# EAGLE schematic GPIOexpander (EAGLE 9.4.2)
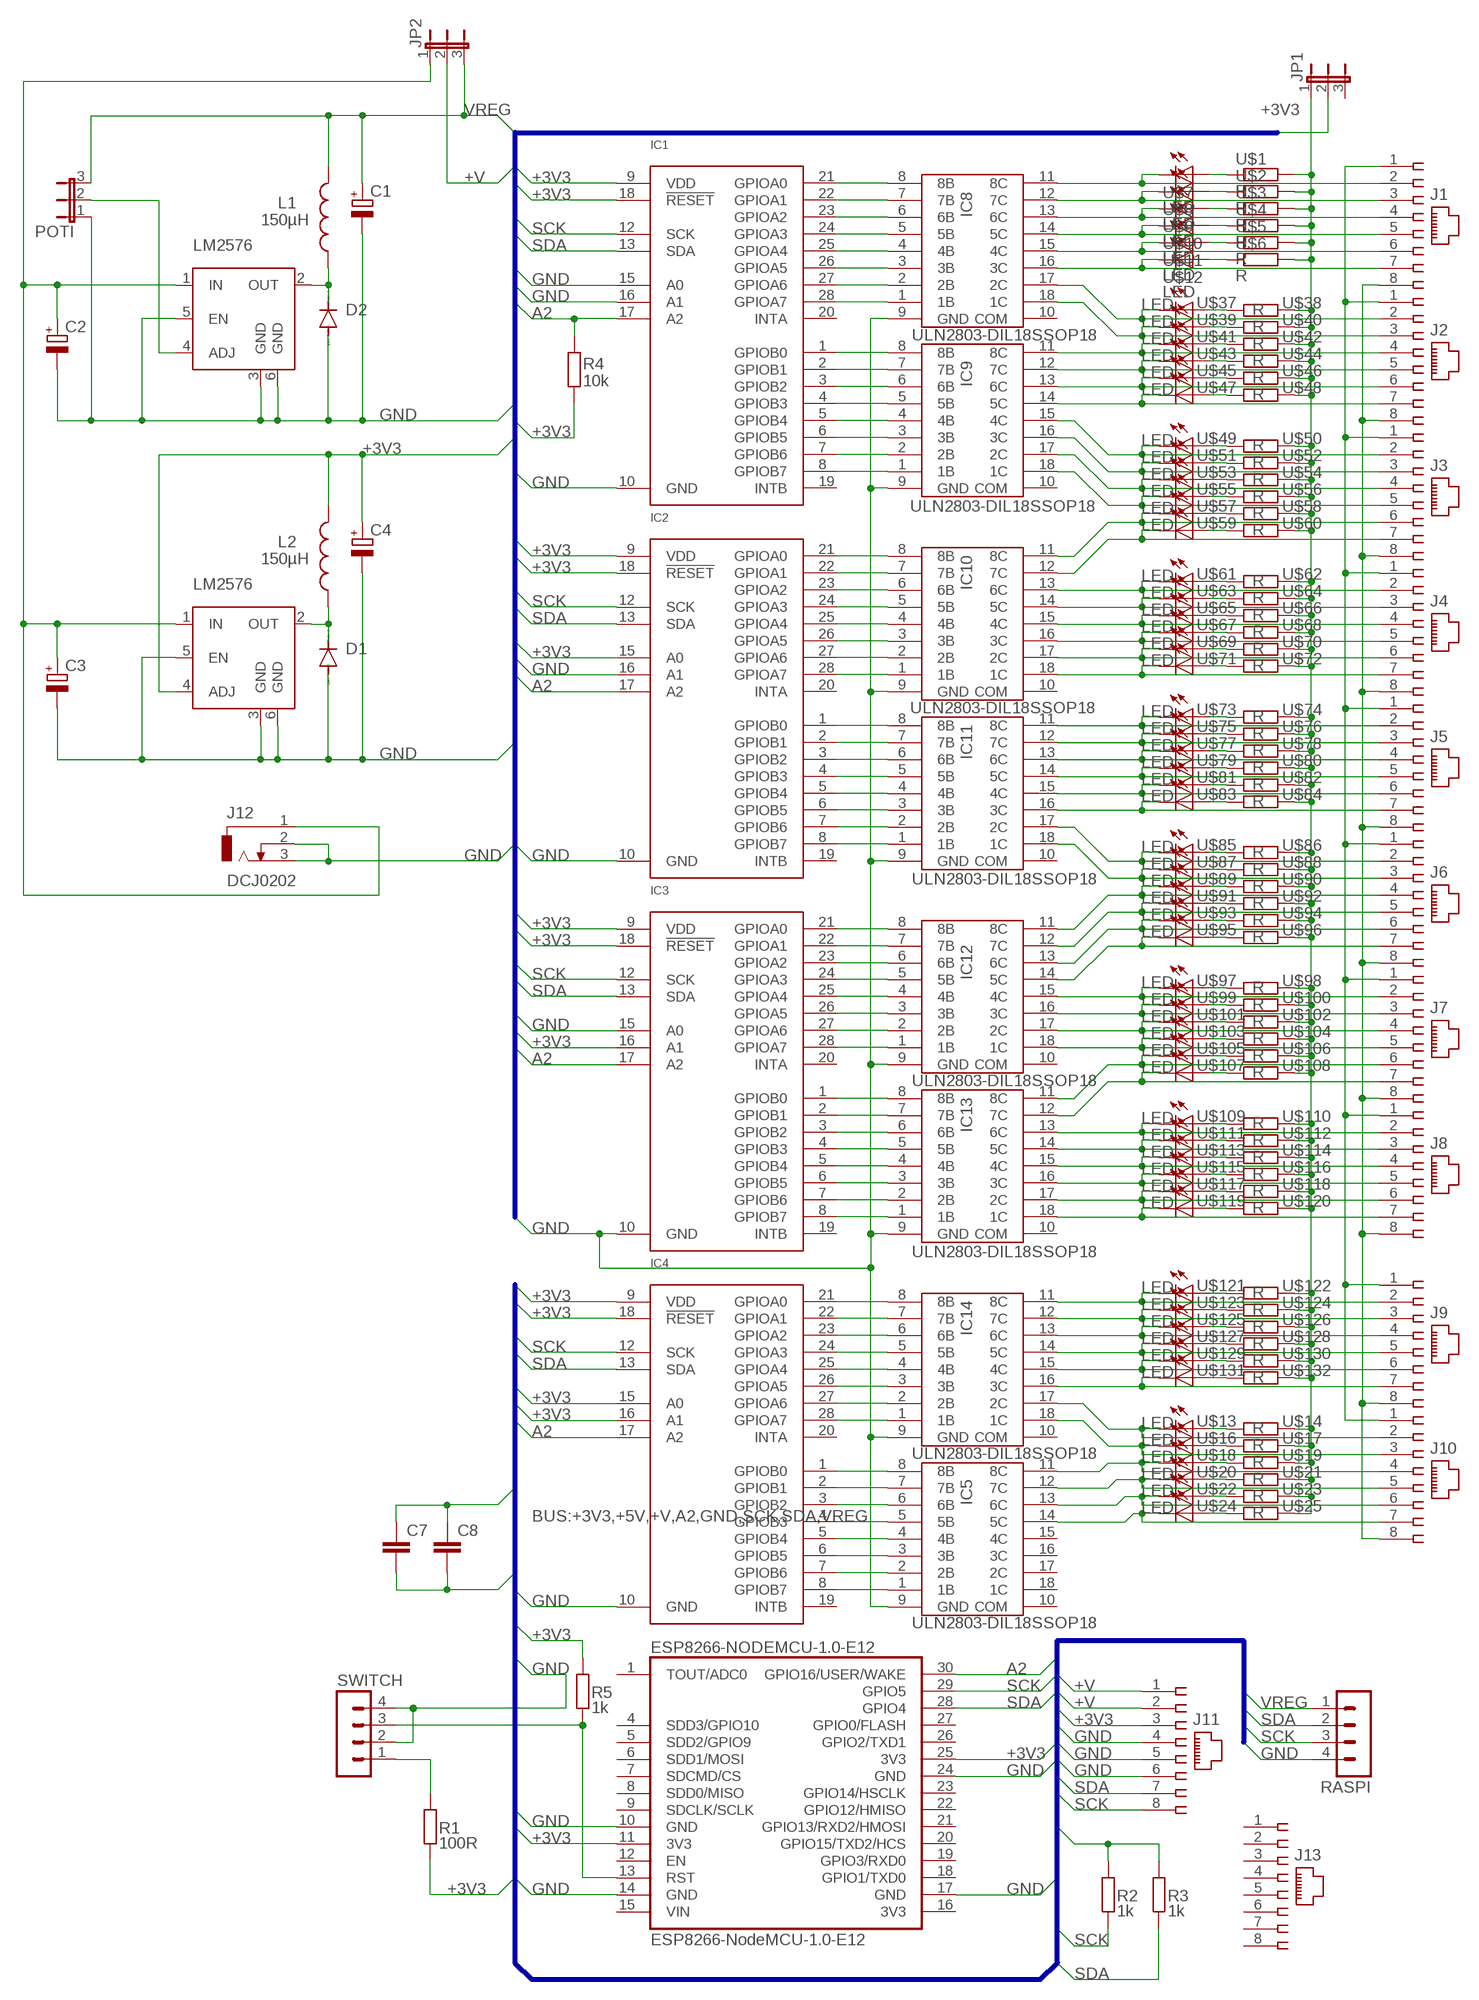
[diagram p0: schematic, sheet 1]

## Parts
C1  CPOL-EUE5-10.5  [E5-10,5]
C2  CPOL-EUE5-10.5  [E5-10,5]
C3  CPOL-EUE5-10.5  [E5-10,5]
C4  CPOL-EUE5-10.5  [E5-10,5]
C7  C-EUC0805  [C0805]
C8  C-EUC0805  [C0805]
D1  DIODE-SMB  [SMB]
D2  DIODE-SMB  [SMB]
ESP8266-NODEMCU-1.0-E12  ESP8266-NodeMCU-1.0-E12  MCP8266-MODULE  [MCP8266-MODULE]
IC1  MCP23017-DIL28-3SSOP28  [SO28W]
IC2  MCP23017-DIL28-3SSOP28  [SO28W]
IC3  MCP23017-DIL28-3SSOP28  [SO28W]
IC4  MCP23017-DIL28-3SSOP28  [SO28W]
IC5  ULN2803-DIL18SSOP18  [SO18W]
IC8  ULN2803-DIL18SSOP18  [SO18W]
IC9  ULN2803-DIL18SSOP18  [SO18W]
IC10  ULN2803-DIL18SSOP18  [SO18W]
IC11  ULN2803-DIL18SSOP18  [SO18W]
IC12  ULN2803-DIL18SSOP18  [SO18W]
IC13  ULN2803-DIL18SSOP18  [SO18W]
IC14  ULN2803-DIL18SSOP18  [SO18W]
J1  215877-7  [215877-7]
J2  215877-7  [215877-7]
J3  215877-7  [215877-7]
J4  215877-7  [215877-7]
J5  215877-7  [215877-7]
J6  215877-7  [215877-7]
J7  215877-7  [215877-7]
J8  215877-7  [215877-7]
J9  215877-7  [215877-7]
J10  215877-7  [215877-7]
J11  215877-7  [215877-7]
J12  DCJ0202  [DCJ0303]
J13  215877-7  [215877-7]
JP1  JP2E  [JP2]
JP2  JP2E  [JP2]
L1  150µH  BIG_COILS  [BIG_COIL]
L2  150µH  BIG_COILS  [BIG_COIL]
POTI  JP2E  [JP2]
R1  100R  R  [C0805]
R2  1k  R  [C0805]
R3  1k  R  [C0805]
R4  10k  R  [C0805]
R5  1k  R  [C0805]
RASPI  MA04-1  [MA04-1]
SWITCH  MA04-1  [MA04-1]
U$1  R  [C0805]
U$2  R  [C0805]
U$3  R  [C0805]
U$4  R  [C0805]
U$5  R  [C0805]
U$6  R  [C0805]
U$7  LED  [C0805]
U$8  LED  [C0805]
U$9  LED  [C0805]
U$10  LED  [C0805]
U$11  LED  [C0805]
U$12  LED  [C0805]
U$13  LED  [C0805]
U$14  R  [C0805]
U$16  LED  [C0805]
U$17  R  [C0805]
U$18  LED  [C0805]
U$19  R  [C0805]
U$20  LED  [C0805]
U$21  R  [C0805]
U$22  LED  [C0805]
U$23  R  [C0805]
U$24  LED  [C0805]
U$25  R  [C0805]
U$26  LM2576  [D2PAK]
U$28  LM2576  [D2PAK]
U$37  LED  [C0805]
U$38  R  [C0805]
U$39  LED  [C0805]
U$40  R  [C0805]
U$41  LED  [C0805]
U$42  R  [C0805]
U$43  LED  [C0805]
U$44  R  [C0805]
U$45  LED  [C0805]
U$46  R  [C0805]
U$47  LED  [C0805]
U$48  R  [C0805]
U$49  LED  [C0805]
U$50  R  [C0805]
U$51  LED  [C0805]
U$52  R  [C0805]
U$53  LED  [C0805]
U$54  R  [C0805]
U$55  LED  [C0805]
U$56  R  [C0805]
U$57  LED  [C0805]
U$58  R  [C0805]
U$59  LED  [C0805]
U$60  R  [C0805]
U$61  LED  [C0805]
U$62  R  [C0805]
U$63  LED  [C0805]
U$64  R  [C0805]
U$65  LED  [C0805]
U$66  R  [C0805]
U$67  LED  [C0805]
U$68  R  [C0805]
U$69  LED  [C0805]
U$70  R  [C0805]
U$71  LED  [C0805]
U$72  R  [C0805]
U$73  LED  [C0805]
U$74  R  [C0805]
U$75  LED  [C0805]
U$76  R  [C0805]
U$77  LED  [C0805]
U$78  R  [C0805]
U$79  LED  [C0805]
U$80  R  [C0805]
U$81  LED  [C0805]
U$82  R  [C0805]
U$83  LED  [C0805]
U$84  R  [C0805]
U$85  LED  [C0805]
U$86  R  [C0805]
U$87  LED  [C0805]
U$88  R  [C0805]
U$89  LED  [C0805]
U$90  R  [C0805]
U$91  LED  [C0805]
U$92  R  [C0805]
U$93  LED  [C0805]
U$94  R  [C0805]
U$95  LED  [C0805]
U$96  R  [C0805]
U$97  LED  [C0805]
U$98  R  [C0805]
U$99  LED  [C0805]
U$100  R  [C0805]
U$101  LED  [C0805]
U$102  R  [C0805]
U$103  LED  [C0805]
U$104  R  [C0805]
U$105  LED  [C0805]
U$106  R  [C0805]
U$107  LED  [C0805]
U$108  R  [C0805]
U$109  LED  [C0805]
U$110  R  [C0805]
U$111  LED  [C0805]
U$112  R  [C0805]
U$113  LED  [C0805]
U$114  R  [C0805]
U$115  LED  [C0805]
U$116  R  [C0805]
U$117  LED  [C0805]
U$118  R  [C0805]
U$119  LED  [C0805]
U$120  R  [C0805]
U$121  LED  [C0805]
U$122  R  [C0805]
U$123  LED  [C0805]
U$124  R  [C0805]
U$125  LED  [C0805]
U$126  R  [C0805]
U$127  LED  [C0805]
U$128  R  [C0805]
U$129  LED  [C0805]
U$130  R  [C0805]
U$131  LED  [C0805]
U$132  R  [C0805]

## Nets
+3V3: C4.+ C7.1 C8.1 ESP8266-NODEMCU-1.0-E12.11(3V3) ESP8266-NODEMCU-1.0-E12.25(3V3) IC1.9(VDD) IC1.18(!RESET) IC2.9(VDD) IC2.15(A0) IC2.18(!RESET) IC3.9(VDD) IC3.16(A1) IC3.18(!RESET) IC4.9(VDD) IC4.15(A0) IC4.16(A1) IC4.18(!RESET) J11.3 JP1.2 L2.P$2 R1.1 R2.2 R3.2 R4.1 R5.2 U$28.4(ADJ)
+V: J1.1 J2.1 J3.1 J4.1 J5.1 J6.1 J7.1 J8.1 J9.1 J10.1 J11.1 J11.2 JP2.2
A2: ESP8266-NODEMCU-1.0-E12.30(GPIO16/USER/WAKE) IC1.17(A2) IC2.17(A2) IC3.17(A2) IC4.17(A2) R4.2
GND: C1.- C2.- C3.- C4.- C7.2 C8.2 D1.A D2.A ESP8266-NODEMCU-1.0-E12.10(GND) ESP8266-NODEMCU-1.0-E12.14(GND) ESP8266-NODEMCU-1.0-E12.17(GND) ESP8266-NODEMCU-1.0-E12.24(GND) IC1.10(GND) IC1.15(A0) IC1.16(A1) IC2.10(GND) IC2.16(A1) IC3.10(GND) IC3.15(A0) IC4.10(GND) IC5.9(GND) IC8.9(GND) IC9.9(GND) IC10.9(GND) IC11.9(GND) IC12.9(GND) IC13.9(GND) IC14.9(GND) J1.8 J2.8 J3.8 J4.8 J5.8 J6.8 J7.8 J8.8 J9.8 J10.8 J11.4 J11.5 J11.6 J12.2 J12.3 POTI.1 RASPI.4 SWITCH.2 SWITCH.4 U$26.3(GND) U$26.5(EN) U$26.6(GND) U$28.3(GND) U$28.5(EN) U$28.6(GND)
N$1: IC1.21(GPIOA0) IC8.8(8B)
N$2: IC1.22(GPIOA1) IC8.7(7B)
N$3: IC1.23(GPIOA2) IC8.6(6B)
N$4: IC1.24(GPIOA3) IC8.5(5B)
N$5: IC1.25(GPIOA4) IC8.4(4B)
N$6: IC1.26(GPIOA5) IC8.3(3B)
N$7: IC1.27(GPIOA6) IC8.2(2B)
N$8: IC1.28(GPIOA7) IC8.1(1B)
N$9: IC4.8(GPIOB7) IC5.1(1B)
N$10: IC1.1(GPIOB0) IC9.8(8B)
N$11: IC1.2(GPIOB1) IC9.7(7B)
N$12: IC1.3(GPIOB2) IC9.6(6B)
N$13: IC1.4(GPIOB3) IC9.5(5B)
N$14: IC1.5(GPIOB4) IC9.4(4B)
N$15: IC1.6(GPIOB5) IC9.3(3B)
N$16: IC1.7(GPIOB6) IC9.2(2B)
N$17: IC1.8(GPIOB7) IC9.1(1B)
N$18: IC4.7(GPIOB6) IC5.2(2B)
N$19: IC2.21(GPIOA0) IC10.8(8B)
N$20: IC2.22(GPIOA1) IC10.7(7B)
N$21: IC2.23(GPIOA2) IC10.6(6B)
N$22: IC2.24(GPIOA3) IC10.5(5B)
N$23: IC2.25(GPIOA4) IC10.4(4B)
N$24: IC2.26(GPIOA5) IC10.3(3B)
N$25: IC2.27(GPIOA6) IC10.2(2B)
N$26: IC2.28(GPIOA7) IC10.1(1B)
N$27: IC4.6(GPIOB5) IC5.3(3B)
N$28: IC2.1(GPIOB0) IC11.8(8B)
N$29: IC2.2(GPIOB1) IC11.7(7B)
N$30: IC2.3(GPIOB2) IC11.6(6B)
N$31: IC2.4(GPIOB3) IC11.5(5B)
N$32: IC2.5(GPIOB4) IC11.4(4B)
N$33: IC2.6(GPIOB5) IC11.3(3B)
N$34: IC2.7(GPIOB6) IC11.2(2B)
N$35: IC2.8(GPIOB7) IC11.1(1B)
N$36: IC9.15(4C) J3.2 U$49.2(C)
N$37: IC3.21(GPIOA0) IC12.8(8B)
N$38: IC3.22(GPIOA1) IC12.7(7B)
N$39: IC3.23(GPIOA2) IC12.6(6B)
N$40: IC3.24(GPIOA3) IC12.5(5B)
N$41: IC3.25(GPIOA4) IC12.4(4B)
N$42: IC3.26(GPIOA5) IC12.3(3B)
N$43: IC3.27(GPIOA6) IC12.2(2B)
N$44: IC3.28(GPIOA7) IC12.1(1B)
N$45: IC9.16(3C) J3.3 U$51.2(C)
N$46: IC3.1(GPIOB0) IC13.8(8B)
N$47: IC3.2(GPIOB1) IC13.7(7B)
N$48: IC3.3(GPIOB2) IC13.6(6B)
N$49: IC3.4(GPIOB3) IC13.5(5B)
N$50: IC3.5(GPIOB4) IC13.4(4B)
N$51: IC3.6(GPIOB5) IC13.3(3B)
N$52: IC3.7(GPIOB6) IC13.2(2B)
N$53: IC3.8(GPIOB7) IC13.1(1B)
N$54: IC9.17(2C) J3.4 U$53.2(C)
N$55: IC4.21(GPIOA0) IC14.8(8B)
N$56: IC4.22(GPIOA1) IC14.7(7B)
N$57: IC4.23(GPIOA2) IC14.6(6B)
N$58: IC4.24(GPIOA3) IC14.5(5B)
N$59: IC4.25(GPIOA4) IC14.4(4B)
N$60: IC4.26(GPIOA5) IC14.3(3B)
N$61: IC4.27(GPIOA6) IC14.2(2B)
N$62: IC4.28(GPIOA7) IC14.1(1B)
N$63: IC8.17(2C) J2.2 U$37.2(C)
N$64: IC4.5(GPIOB4) IC5.4(4B)
N$65: IC4.4(GPIOB3) IC5.5(5B)
N$66: IC4.3(GPIOB2) IC5.6(6B)
N$67: IC4.2(GPIOB1) IC5.7(7B)
N$68: IC4.1(GPIOB0) IC5.8(8B)
N$69: IC14.17(2C) J10.2 U$13.2(C)
N$70: JP1.1 U$1.2 U$2.2 U$3.2 U$4.2 U$5.2 U$6.2 U$14.2 U$17.2 U$19.2 U$21.2 U$23.2 U$25.2 U$38.2 U$40.2 U$42.2 U$44.2 U$46.2 U$48.2 U$50.2 U$52.2 U$54.2 U$56.2 U$58.2 U$60.2 U$62.2 U$64.2 U$66.2 U$68.2 U$70.2 U$72.2 U$74.2 U$76.2 U$78.2 U$80.2 U$82.2 U$84.2 U$86.2 U$88.2 U$90.2 U$92.2 U$94.2 U$96.2 U$98.2 U$100.2 U$102.2 U$104.2 U$106.2 U$108.2 U$110.2 U$112.2 U$114.2 U$116.2 U$118.2 U$120.2 U$122.2 U$124.2 U$126.2 U$128.2 U$130.2 U$132.2
N$71: D2.C L1.P$1 U$26.2(OUT)
N$72: IC8.11(8C) J1.2 U$7.2(C)
N$73: C2.+ C3.+ J12.1 JP2.1 U$26.1(IN) U$28.1(IN)
N$74: IC14.18(1C) J10.3 U$16.2(C)
N$75: IC5.11(8C) J10.4 U$18.2(C)
N$76: IC5.12(7C) J10.5 U$20.2(C)
N$77: IC5.13(6C) J10.6 U$22.2(C)
N$78: IC5.14(5C) J10.7 U$24.2(C)
N$79: U$13.1(A) U$14.1
N$80: U$16.1(A) U$17.1
N$81: IC8.18(1C) J2.3 U$39.2(C)
N$82: U$18.1(A) U$19.1
N$83: U$20.1(A) U$21.1
N$84: U$22.1(A) U$23.1
N$85: U$24.1(A) U$25.1
N$86: POTI.2 U$26.4(ADJ)
N$87: D1.C L2.P$1 U$28.2(OUT)
N$88: ESP8266-NODEMCU-1.0-E12.13(RST) R5.1 SWITCH.3
N$89: R1.2 SWITCH.1
N$90: IC9.12(7C) J2.5 U$43.2(C)
N$99: IC9.11(8C) J2.4 U$41.2(C)
N$128: IC9.18(1C) J3.5 U$55.2(C)
N$215: IC10.11(8C) J3.6 U$57.2(C)
N$217: IC8.12(7C) J1.3 U$8.2(C)
N$218: IC8.13(6C) J1.4 U$9.2(C)
N$223: IC9.13(6C) J2.6 U$45.2(C)
N$224: IC9.14(5C) J2.7 U$47.2(C)
N$225: IC8.14(5C) J1.5 U$10.2(C)
N$226: IC8.15(4C) J1.6 U$11.2(C)
N$228: IC8.16(3C) J1.7 U$12.2(C)
N$229: IC10.12(7C) J3.7 U$59.2(C)
N$230: IC10.13(6C) J4.2 U$61.2(C)
N$232: IC10.14(5C) J4.3 U$63.2(C)
N$233: IC10.15(4C) J4.4 U$65.2(C)
N$234: IC10.16(3C) J4.5 U$67.2(C)
N$235: IC10.17(2C) J4.6 U$69.2(C)
N$238: IC10.18(1C) J4.7 U$71.2(C)
N$239: IC11.14(5C) J5.5 U$79.2(C)
N$240: IC11.15(4C) J5.6 U$81.2(C)
N$241: IC11.16(3C) J5.7 U$83.2(C)
N$242: IC11.11(8C) J5.2 U$73.2(C)
N$243: IC11.12(7C) J5.3 U$75.2(C)
N$244: IC11.13(6C) J5.4 U$77.2(C)
N$245: IC11.17(2C) J6.2 U$85.2(C)
N$246: IC11.18(1C) J6.3 U$87.2(C)
N$247: IC12.11(8C) J6.4 U$89.2(C)
N$248: IC12.12(7C) J6.5 U$91.2(C)
N$249: IC12.13(6C) J6.6 U$93.2(C)
N$250: IC12.14(5C) J6.7 U$95.2(C)
N$251: IC12.15(4C) J7.2 U$97.2(C)
N$252: IC12.16(3C) J7.3 U$99.2(C)
N$253: IC12.17(2C) J7.4 U$101.2(C)
N$254: IC12.18(1C) J7.5 U$103.2(C)
N$255: IC13.11(8C) J7.6 U$105.2(C)
N$256: IC13.12(7C) J7.7 U$107.2(C)
N$257: IC13.13(6C) J8.2 U$109.2(C)
N$258: IC13.14(5C) J8.3 U$111.2(C)
N$259: IC13.15(4C) J8.4 U$113.2(C)
N$260: IC13.16(3C) J8.5 U$115.2(C)
N$261: IC13.17(2C) J8.6 U$117.2(C)
N$262: IC13.18(1C) J8.7 U$119.2(C)
N$263: IC14.11(8C) J9.2 U$121.2(C)
N$264: IC14.12(7C) J9.3 U$123.2(C)
N$265: IC14.13(6C) J9.4 U$125.2(C)
N$266: IC14.14(5C) J9.5 U$127.2(C)
N$267: IC14.15(4C) J9.6 U$129.2(C)
N$268: IC14.16(3C) J9.7 U$131.2(C)
N$329: U$1.1 U$7.1(A)
N$330: U$2.1 U$8.1(A)
N$331: U$3.1 U$9.1(A)
N$332: U$4.1 U$10.1(A)
N$333: U$5.1 U$11.1(A)
N$334: U$6.1 U$12.1(A)
N$347: U$37.1(A) U$38.1
N$348: U$39.1(A) U$40.1
N$349: U$41.1(A) U$42.1
N$350: U$43.1(A) U$44.1
N$351: U$45.1(A) U$46.1
N$352: U$47.1(A) U$48.1
N$353: U$49.1(A) U$50.1
N$354: U$51.1(A) U$52.1
N$355: U$53.1(A) U$54.1
N$356: U$55.1(A) U$56.1
N$357: U$57.1(A) U$58.1
N$358: U$59.1(A) U$60.1
N$359: U$61.1(A) U$62.1
N$360: U$63.1(A) U$64.1
N$361: U$65.1(A) U$66.1
N$362: U$67.1(A) U$68.1
N$363: U$69.1(A) U$70.1
N$364: U$71.1(A) U$72.1
N$365: U$73.1(A) U$74.1
N$366: U$75.1(A) U$76.1
N$367: U$77.1(A) U$78.1
N$368: U$79.1(A) U$80.1
N$369: U$81.1(A) U$82.1
N$370: U$83.1(A) U$84.1
N$371: U$85.1(A) U$86.1
N$372: U$87.1(A) U$88.1
N$373: U$89.1(A) U$90.1
N$374: U$91.1(A) U$92.1
N$375: U$93.1(A) U$94.1
N$376: U$95.1(A) U$96.1
N$377: U$97.1(A) U$98.1
N$378: U$99.1(A) U$100.1
N$379: U$101.1(A) U$102.1
N$380: U$103.1(A) U$104.1
N$381: U$105.1(A) U$106.1
N$382: U$107.1(A) U$108.1
N$383: U$109.1(A) U$110.1
N$384: U$111.1(A) U$112.1
N$385: U$113.1(A) U$114.1
N$386: U$115.1(A) U$116.1
N$387: U$117.1(A) U$118.1
N$388: U$119.1(A) U$120.1
N$389: U$121.1(A) U$122.1
N$390: U$123.1(A) U$124.1
N$391: U$125.1(A) U$126.1
N$392: U$127.1(A) U$128.1
N$393: U$129.1(A) U$130.1
N$394: U$131.1(A) U$132.1
SCK: ESP8266-NODEMCU-1.0-E12.29(GPIO5) IC1.12(SCK) IC2.12(SCK) IC3.12(SCK) IC4.12(SCK) J11.8 R2.1 RASPI.3
SDA: ESP8266-NODEMCU-1.0-E12.28(GPIO4) IC1.13(SDA) IC2.13(SDA) IC3.13(SDA) IC4.13(SDA) J11.7 R3.1 RASPI.2
VREG: C1.+ JP2.3 L1.P$2 POTI.3 RASPI.1
Unconnected: ESP8266-NODEMCU-1.0-E12.1(TOUT/ADC0) ESP8266-NODEMCU-1.0-E12.4(SDD3/GPIO10) ESP8266-NODEMCU-1.0-E12.5(SDD2/GPIO9) ESP8266-NODEMCU-1.0-E12.6(SDD1/MOSI) ESP8266-NODEMCU-1.0-E12.7(SDCMD/CS) ESP8266-NODEMCU-1.0-E12.8(SDD0/MISO) ESP8266-NODEMCU-1.0-E12.9(SDCLK/SCLK) ESP8266-NODEMCU-1.0-E12.12(EN) ESP8266-NODEMCU-1.0-E12.15(VIN) ESP8266-NODEMCU-1.0-E12.16(3V3) ESP8266-NODEMCU-1.0-E12.18(GPIO1/TXD0) ESP8266-NODEMCU-1.0-E12.19(GPIO3/RXD0) ESP8266-NODEMCU-1.0-E12.20(GPIO15/TXD2/HCS) ESP8266-NODEMCU-1.0-E12.21(GPIO13/RXD2/HMOSI) ESP8266-NODEMCU-1.0-E12.22(GPIO12/HMISO) ESP8266-NODEMCU-1.0-E12.23(GPIO14/HSCLK) ESP8266-NODEMCU-1.0-E12.26(GPIO2/TXD1) ESP8266-NODEMCU-1.0-E12.27(GPIO0/FLASH) IC1.19(INTB) IC1.20(INTA) IC2.19(INTB) IC2.20(INTA) IC3.19(INTB) IC3.20(INTA) IC4.19(INTB) IC4.20(INTA) IC5.10(COM) IC5.15(4C) IC5.16(3C) IC5.17(2C) IC5.18(1C) IC8.10(COM) IC9.10(COM) IC10.10(COM) IC11.10(COM) IC12.10(COM) IC13.10(COM) IC14.10(COM) J13.1 J13.2 J13.3 J13.4 J13.5 J13.6 J13.7 J13.8 JP1.3

## Buses
BUS:+3V3,+5V,+V,A2,GND,SCK,SDA,VREG

## Library data of the parts
C1-C4 = rcl:CPOL-EU: POLARIZED CAPACITOR, European symbol; SPICEPREFIX: C
C7 C8 = rcl:C-EU: CAPACITOR, European symbol; SPICEPREFIX: C
D1 D2 = diode:DIODE-: DIODE
ESP8266-NODEMCU-1.0-E12 = GPIOexpander:MCP8266-MODULE
IC1 = GPIOexpander:MCP23017-DIL28-3: GPIO expander; SPICEPREFIX: X
IC2-IC4 = GPIOexpander:MCP23017-DIL28-3: GPIO expander
IC5 IC8-IC14 = GPIOexpander:ULN2803-DIL18
J1-J11 J13 = con-amp:215877-7: AMP connector
J12 = GPIOexpander:DCJ0202: DC POWER JACK Source: DCJ0202.pdf
JP1 JP2 POTI = jumper-alex:JP2E: JUMPER
L1 L2 = GPIOexpander:BIG_COILS
R1-R5 U$1-U$6 U$14 U$17 U$19 U$21 U$23 U$25 U$38 U$40 U$42 U$44 U$46 U$48 U$50 U$52 U$54 U$56 U$58 U$60 U$62 U$64 U$66 U$68 U$70 U$72 U$74 U$76 U$78 U$80 U$82 U$84 U$86 U$88 U$90 U$92 U$94 U$96 U$98 U$100 U$102 U$104 U$106 U$108 U$110 U$112 U$114 U$116 U$118 U$120 U$122 U$124 U$126 U$128 U$130 U$132 = GPIOexpander:R
RASPI SWITCH = con-lstb:MA04-1: PIN HEADER; OC_FARNELL: unknown; OC_NEWARK: unknown
U$7-U$13 U$16 U$18 U$20 U$22 U$24 U$37 U$39 U$41 U$43 U$45 U$47 U$49 U$51 U$53 U$55 U$57 U$59 U$61 U$63 U$65 U$67 U$69 U$71 U$73 U$75 U$77 U$79 U$81 U$83 U$85 U$87 U$89 U$91 U$93 U$95 U$97 U$99 U$101 U$103 U$105 U$107 U$109 U$111 U$113 U$115 U$117 U$119 U$121 U$123 U$125 U$127 U$129 U$131 = GPIOexpander:LED
U$26 U$28 = GPIOexpander:LM2576